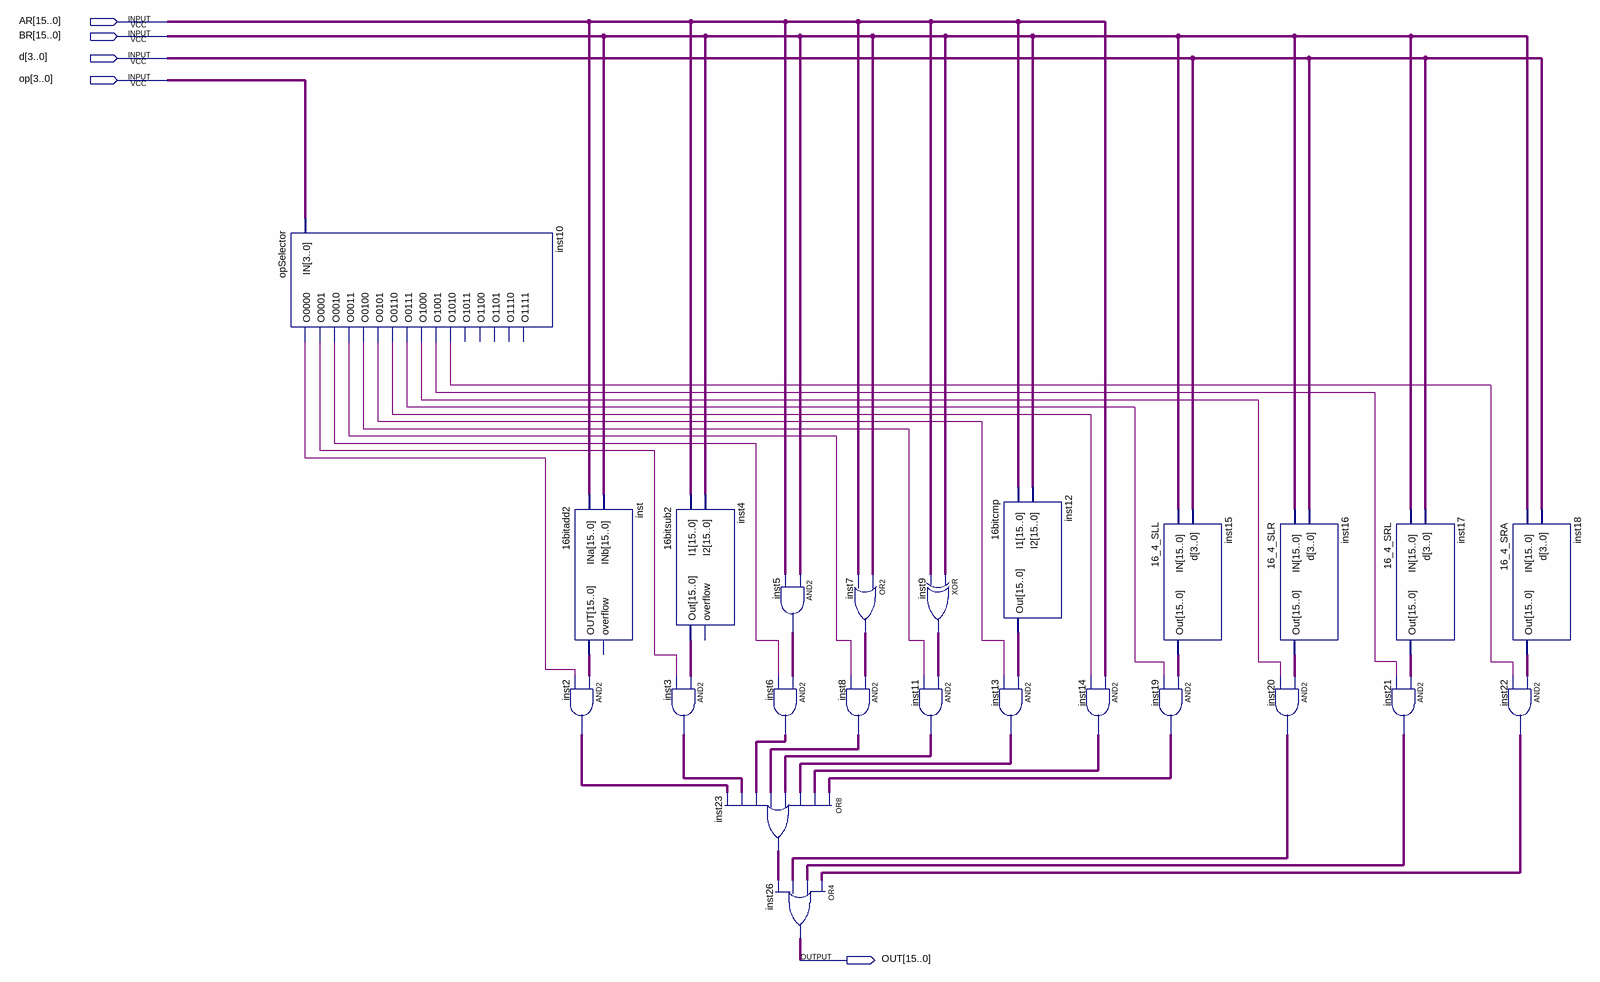
[diagram p0: schematic sheet]
// Quartus schematic ALU.bdf as structural Verilog: 24 symbols, 5 pins
module ALU (
  input  [15:0] AR,
  input  [15:0] BR,
  input  [3:0] d,
  input  [3:0] op,
  output [15:0] OUT
);

  wire inst10_o0000, inst10_o0001, inst10_o0010, inst10_o0011, inst10_o0100, inst10_o0101, inst10_o0110,
       inst10_o0111, inst10_o1000, inst10_o1001, inst10_o1010;
  wire [15:0] inst2_out, inst3_out, inst4_out, inst5_out, inst6_out, inst7_out, inst8_out, inst9_out,
       inst11_out, inst12_out, inst13_out, inst14_out, inst15_out, inst16_out, inst17_out, inst18_out,
       inst19_out, inst20_out, inst21_out, inst22_out, inst23_out, inst_out;

  opSelector inst10 (
    .IN(op), .O0000(inst10_o0000), .O0001(inst10_o0001), .O0010(inst10_o0010), .O0011(inst10_o0011),
    .O0100(inst10_o0100), .O0101(inst10_o0101), .O0110(inst10_o0110), .O0111(inst10_o0111),
    .O1000(inst10_o1000), .O1001(inst10_o1001), .O1010(inst10_o1010));  // open: O1011, O1100, O1101, O1110, O1111
  \16bitadd2  inst (.INa(AR), .INb(BR), .OUT(inst_out));  // open: overflow
  assign inst2_out = inst_out & {16{inst10_o0000}};  // AND2 inst2, 16 bits wide
  \16bitsub2  inst4 (.I1(AR), .I2(BR), .Out(inst4_out));  // open: overflow
  assign inst3_out = inst4_out & {16{inst10_o0001}};  // AND2 inst3, 16 bits wide
  assign inst23_out = inst19_out | inst14_out | inst13_out | inst11_out | inst8_out | inst6_out | inst3_out | inst2_out;  // OR8 inst23, 16 bits wide
  assign inst5_out = BR & AR;  // AND2 inst5, 16 bits wide
  assign inst6_out = inst5_out & {16{inst10_o0010}};  // AND2 inst6, 16 bits wide
  assign OUT = inst22_out | inst21_out | inst20_out | inst23_out;  // OR4 inst26, 16 bits wide
  assign inst7_out = BR | AR;  // OR2 inst7, 16 bits wide
  assign inst8_out = inst7_out & {16{inst10_o0011}};  // AND2 inst8, 16 bits wide
  assign inst9_out = BR ^ AR;  // XOR inst9, 16 bits wide
  assign inst11_out = inst9_out & {16{inst10_o0100}};  // AND2 inst11, 16 bits wide
  \16bitcmp  inst12 (.I1(AR), .I2(BR), .Out(inst12_out));
  assign inst13_out = inst12_out & {16{inst10_o0101}};  // AND2 inst13, 16 bits wide
  assign inst14_out = AR & {16{inst10_o0110}};  // AND2 inst14, 16 bits wide
  \16_4_SLL  inst15 (.IN(BR), .d(d), .Out(inst15_out));
  assign inst19_out = inst15_out & {16{inst10_o0111}};  // AND2 inst19, 16 bits wide
  \16_4_SLR  inst16 (.IN(BR), .d(d), .Out(inst16_out));
  assign inst20_out = inst16_out & {16{inst10_o1000}};  // AND2 inst20, 16 bits wide
  \16_4_SRL  inst17 (.IN(BR), .d(d), .Out(inst17_out));
  assign inst21_out = inst17_out & {16{inst10_o1001}};  // AND2 inst21, 16 bits wide
  \16_4_SRA  inst18 (.IN(BR), .d(d), .Out(inst18_out));
  assign inst22_out = inst18_out & {16{inst10_o1010}};  // AND2 inst22, 16 bits wide
endmodule
